# Altium schematic sheet PMIC-MX8M.SchDoc
size A2; SheetNumber: 7; SheetTotal: 15
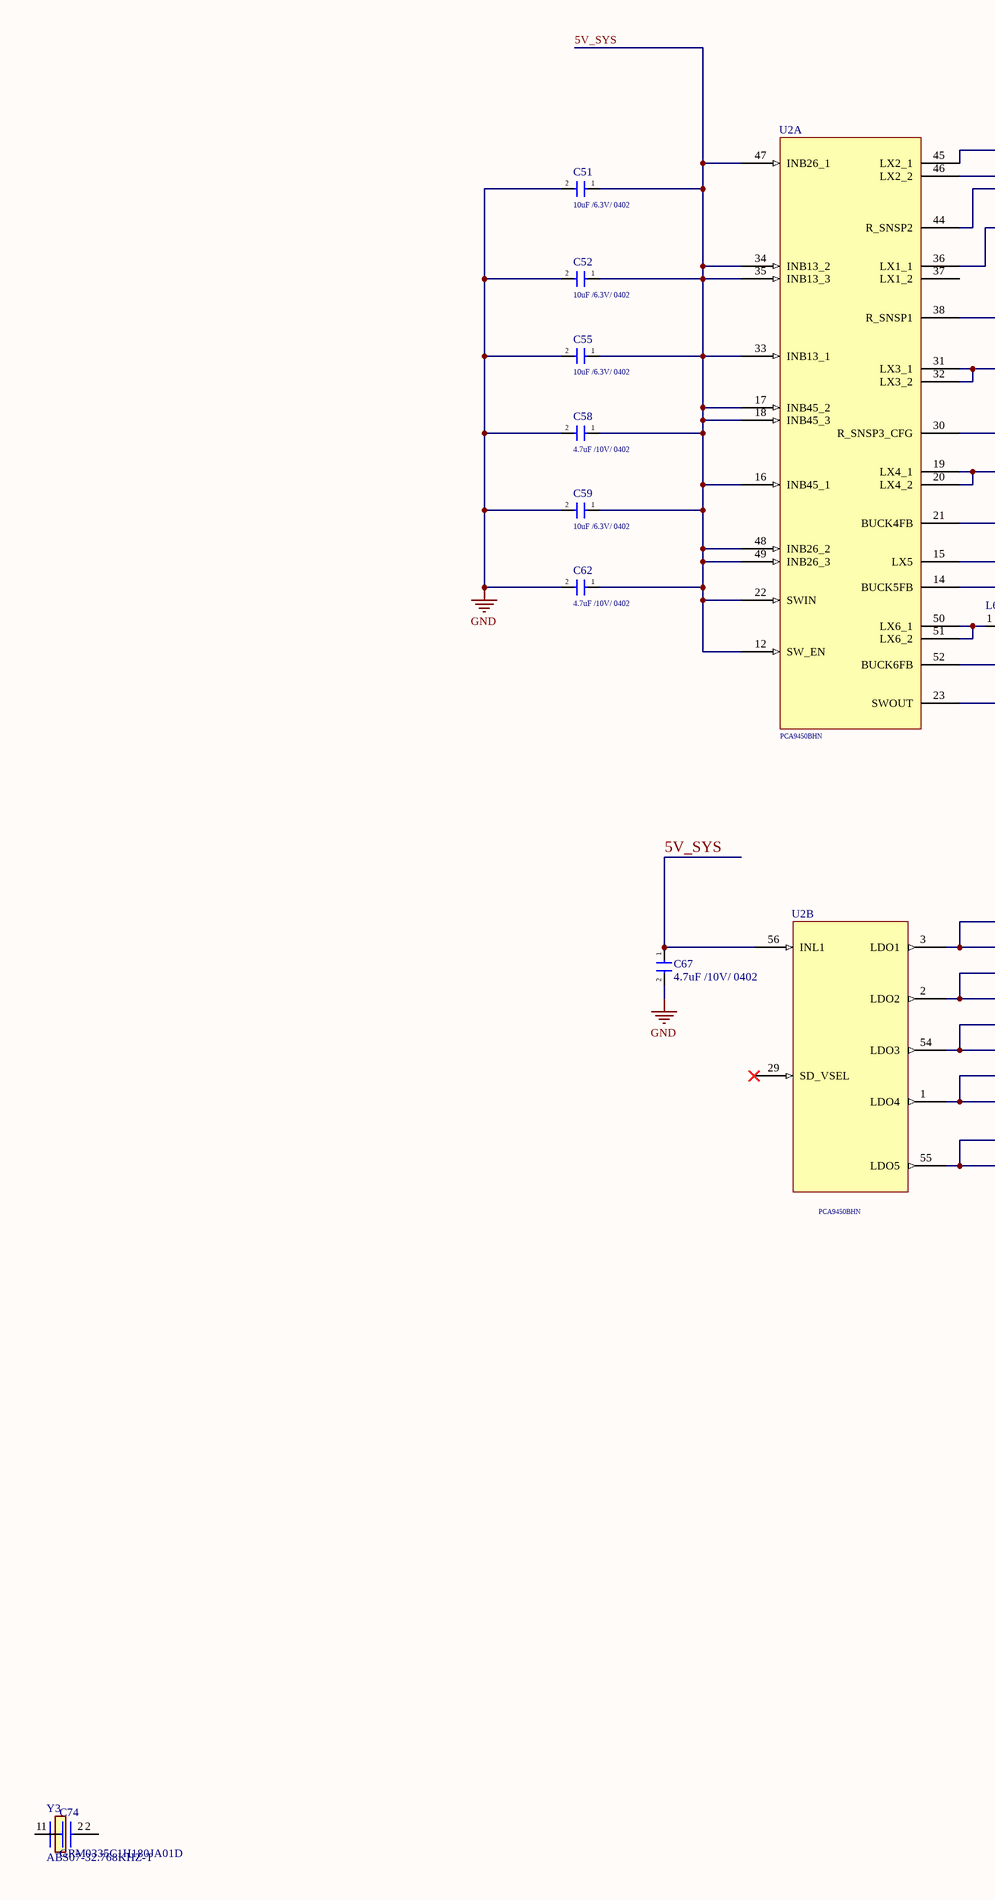
[diagram p0: PMIC-MX8M.SchDoc, left]
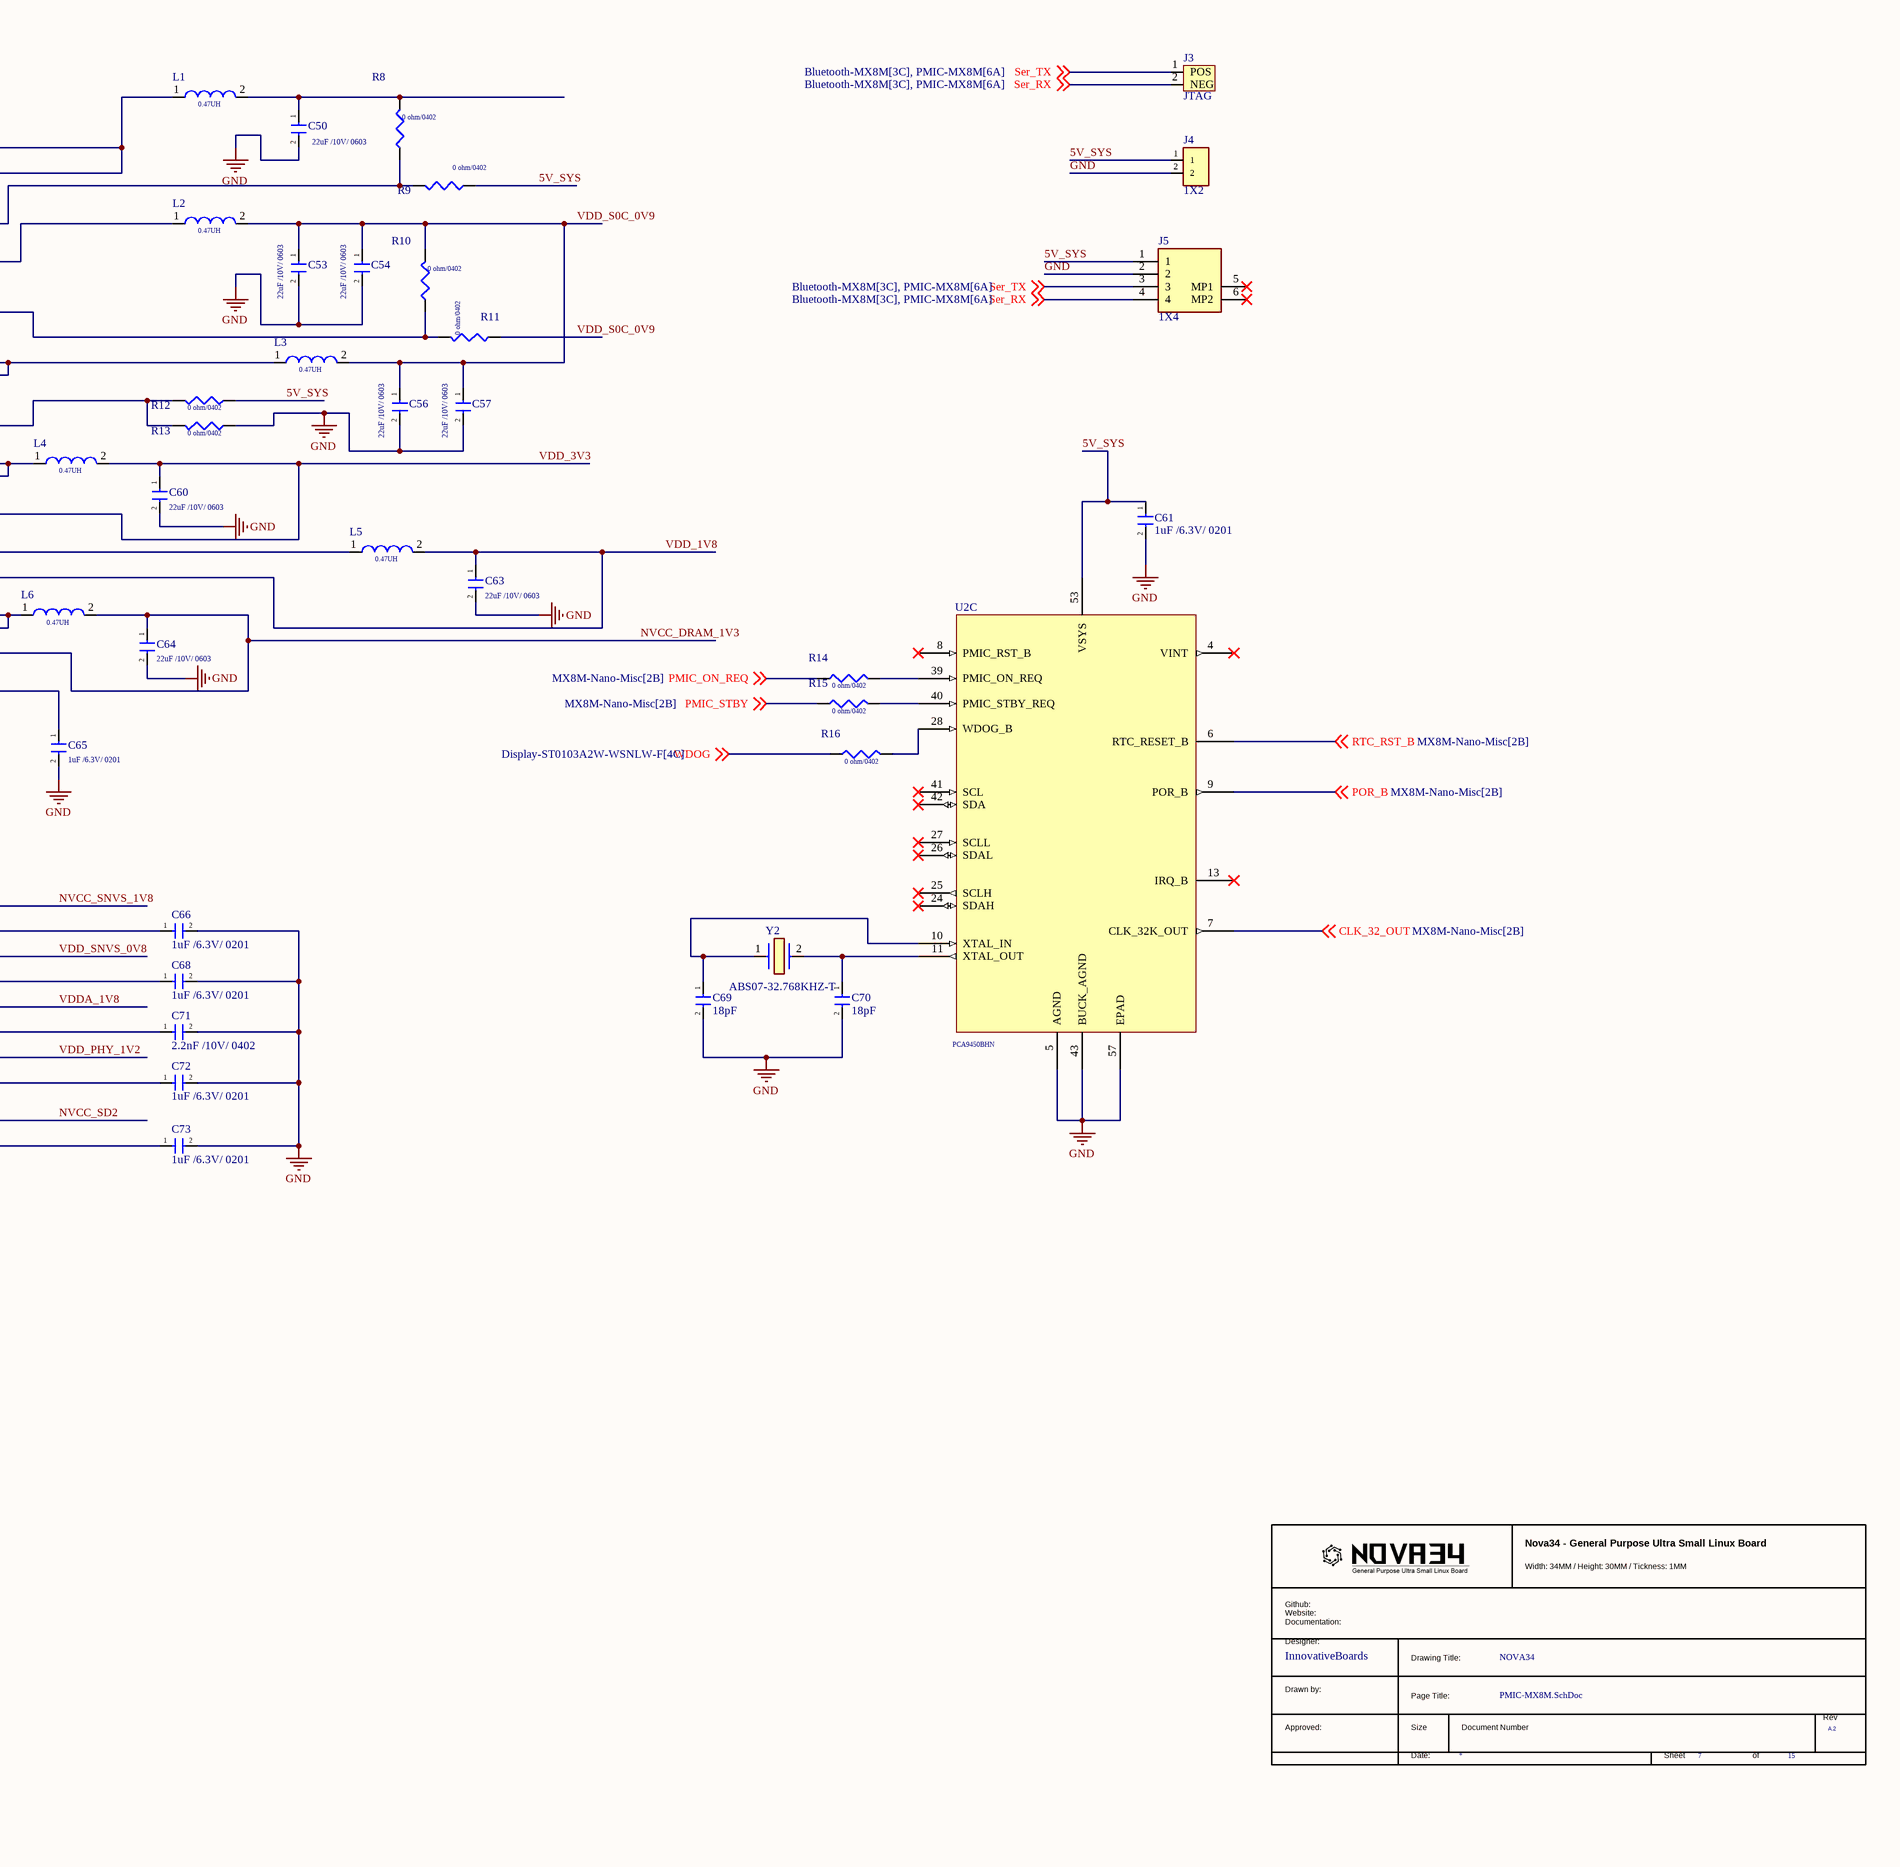
[diagram p1: PMIC-MX8M.SchDoc, right]

## Parts
*  RevCode: A.2  (hidden comment: TitleBlock_MCPG)  (graphical)
C50  22uF /10V/ 0603  [GRM18x]
C51  10uF /6.3V/ 0402  [CAPC1005X65N]
C52  10uF /6.3V/ 0402  [CAPC1005X65N]
C53  22uF /10V/ 0603  [GRM18x]
C54  22uF /10V/ 0603  [GRM18x]
C55  10uF /6.3V/ 0402  [CAPC1005X65N]
C56  22uF /10V/ 0603  [GRM18x]
C57  22uF /10V/ 0603  [GRM18x]
C58  4.7uF /10V/ 0402  [CAPC1005X70N]
C59  10uF /6.3V/ 0402  [CAPC1005X65N]
C60  22uF /10V/ 0603  [GRM18x]
C61  1uF /6.3V/ 0201  [GRM033D70J224ME01D]
C62  4.7uF /10V/ 0402  [CAPC1005X70N]
C63  22uF /10V/ 0603  [GRM18x]
C64  22uF /10V/ 0603  [GRM18x]
C65  1uF /6.3V/ 0201  [GRM033D70J224ME01D]
C66  1uF /6.3V/ 0201  [GRM033D70J224ME01D]
C67  4.7uF /10V/ 0402  [CAPC1005X70N]
C68  1uF /6.3V/ 0201  [GRM033D70J224ME01D]
C69  18pF  [CAPC0603X33N]
C70  18pF  [CAPC0603X33N]
C71  2.2nF /10V/ 0402  [CAPC1005X70N]
C72  1uF /6.3V/ 0201  [GRM033D70J224ME01D]
C73  1uF /6.3V/ 0201  [GRM033D70J224ME01D]
C74  GRM0335C1H180JA01D  [CAPC0603X33N]
J3  JTAG  [JTAG]
J4  1X2  [HDRV2W64P0X254_1X2_508X254X838P]
J5  1X4  [B4BZRSM4TFLFSN]
L1  0.47UH  [IND_SPH2520]
L2  0.47UH  [IND_SPH2520]
L3  0.47UH  [IND_SPH2520]
L4  0.47UH  [IND_SPH2520]
L5  0.47UH  [IND_SPH2520]
L6  0.47UH  [IND_SPH2520]
R8  0 ohm/0402  [RES_0402]
R9  0 ohm/0402  [RES_0402]
R10  0 ohm/0402  [RES_0402]
R11  0 ohm/0402  [RES_0402]
R12  0 ohm/0402  [RES_0402]
R13  0 ohm/0402  [RES_0402]
R14  0 ohm/0402  [RES_0402]
R15  0 ohm/0402  [RES_0402]
R16  0 ohm/0402  [RES_0402]
U2  PCA9450BHN  [QFN40P700X700X100-57N-D]  (parts A,B,C of 3)
Y2  ABS07-32.768KHZ-T  [ABS07]
Y3  ABS07-32.768KHZ-T  [ABS07]

## Nets
GND: C50.2 C51.2 C52.2 C53.2 C54.2 C55.2 C56.2 C57.2 C58.2 C59.2 C60.2 C61.2 C62.2 C63.2 C64.2 C65.2 C66.2 C67.2 C68.2 C69.2 C70.2 C71.2 C72.2 C73.2 J4.2 J5.2 R13.1 U2.5(AGND) U2.43(BUCK_AGND) U2.57(EPAD)
5V_SYS: C51.1 C52.1 C55.1 C58.1 C59.1 C61.1 C62.1 C67.1 J4.1 J5.1 R9.1 R12.1 U2.12(SW_EN) U2.16(INB45_1) U2.17(INB45_2) U2.18(INB45_3) U2.22(SWIN) U2.33(INB13_1) U2.34(INB13_2) U2.35(INB13_3) U2.47(INB26_1) U2.48(INB26_2) U2.49(INB26_3) U2.53(VSYS) U2.56(INL1)
CLK_32_OUT: U2.7(CLK_32K_OUT) ; off-sheet CLK_32_OUT
NVCC_DRAM_1V3: C64.1 L6.2 U2.52(BUCK6FB)
NVCC_SD2: C73.1 U2.55(LDO5)
NVCC_SNVS_1V8: C66.1 U2.3(LDO1)
PMIC_ON_REQ: R14.1 ; off-sheet PMIC_ON_REQ
PMIC_STBY: R15.1 ; off-sheet PMIC_STBY
POR_B: U2.9(POR_B) ; off-sheet POR_B
RTC_RST_B: U2.6(RTC_RESET_B) ; off-sheet RTC_RST_B
Ser_RX: J3.2(NEG) J5.4 ; off-sheet Ser_RX
Ser_TX: J3.1(POS) J5.3 ; off-sheet Ser_TX
VDD_1V8: C63.1 L5.2 U2.14(BUCK5FB)
VDD_3V3: C60.1 L4.2 U2.21(BUCK4FB)
VDD_PHY_1V2: C72.1 U2.1(LDO4)
VDD_S0C_0V9: C53.1 C54.1 C56.1 C57.1 L2.2 L3.2 R10.2 R11.1
VDD_SNVS_0V8: C68.1 U2.2(LDO2)
VDDA_1V8: C71.1 U2.54(LDO3)
WDOG: R16.1 ; off-sheet WDOG
NetC50_1: C50.1 L1.2 R8.2
NetC65_1: C65.1 U2.23(SWOUT)
NetC69_1: C69.1 U2.10(XTAL_IN) Y2.1
NetC70_1: C70.1 U2.11(XTAL_OUT) Y2.2
NetC74_1: C74.1 Y3.1
NetL1_1: L1.1 U2.45(LX2_1) U2.46(LX2_2)
NetL2_1: L2.1 U2.36(LX1_1)
NetL3_1: L3.1 U2.31(LX3_1) U2.32(LX3_2)
NetL4_1: L4.1 U2.19(LX4_1) U2.20(LX4_2)
NetL5_1: L5.1 U2.15(LX5)
NetL6_1: L6.1 U2.50(LX6_1) U2.51(LX6_2)
NetR8_1: R8.1 R9.2 U2.44(R_SNSP2)
NetR10_1: R10.1 R11.2 U2.38(R_SNSP1)
NetR12_2: R12.2 R13.2 U2.30(R_SNSP3_CFG)
NetR14_2: R14.2 U2.39(PMIC_ON_REQ)
NetR15_2: R15.2 U2.40(PMIC_STBY_REQ)
NetR16_2: R16.2 U2.28(WDOG_B)

Not connected (* = marked no-connect by the designer): C74 2; J5 5(MP1)* 6(MP2)*; U2 4(VINT)* 8(PMIC_RST_B)* 13(IRQ_B)* 24(SDAH)* 25(SCLH)* 26(SDAL)* 27(SCLL)* 29(SD_VSEL)* 37(LX1_2) 41(SCL)* 42(SDA)*; Y3 2

## Notes on the sheet
- (in symbol TitleBlock_MCPG) Nova34 - General Purpose Ultra Small Linux Board; Width: 34MM / Height: 30MM / Tickness: 1MM; Github: / Website: / Documentation:; Designer:; InnovativeBoards; Drawing Title:; NOVA34; Drawn by:; Page Title:; Rev; Approved:; Size; Document Number; Date:; Sheet; of

## Library data of the parts
C50 C53 C54 C56 C57 C60 C63 C64 = GRM187R61A226ME15D: Multilayer Ceramic Capacitors MLCC - SMD/SMT 22 uF 10 VDC 20% 0603 X5R; Manufacturer_Name: Murata Electronics; Datasheet Link: https://search.murata.co.jp/Ceramy/image/img/A01X/G101/ENG/GRM187R61A226ME15-01A.pdf; Height: 0.9mm; Manufacturer_Part_Number: GRM187R61A226ME15D; Mouser Part Number: 81-GRM187R61A226ME5D; Mouser Price/Stock: https://www.mouser.co.uk/ProductDetail/Murata-Electronics/GRM187R61A226ME15D?qs=I53XXhTNm8uUaeh8Eawx4Q%3D%3D; Arrow Part Number: GRM187R61A226ME15D; Arrow Price/Stock: https://www.arrow.com/en/products/grm187r61a226me15d/murata-manufacturing?region=nac
C51 C52 C55 C59 = GRM155R60J106ME15D: Multilayer Ceramic Capacitors MLCC - SMD/SMT 10 uF 6.3 VDC 20% 0402 X5R; Manufacturer_Name: Murata Electronics; Datasheet Link: https://search.murata.co.jp/Ceramy/image/img/A01X/G101/ENG/GRM155R60J106ME15-01A.pdf; Height: 0.65mm; Manufacturer_Part_Number: GRM155R60J106ME15D; Mouser Part Number: 81-GRM155R60J106ME5D; Mouser Price/Stock: https://www.mouser.co.uk/ProductDetail/Murata-Electronics/GRM155R60J106ME15D?qs=I53XXhTNm8s65u6%252BR3mHqw%3D%3D; Arrow Part Number: GRM155R60J106ME15D; Arrow Price/Stock: https://www.arrow.com/en/products/grm155r60j106me15d/murata-manufacturing?region=nac
C58 C62 C67 = GRT155C81A475ME13J: Multilayer Ceramic Capacitors MLCC - SMD/SMT 0402 X6S 4.7 F 20 10VDC AEC-Q200; Manufacturer_Name: Murata Electronics; Datasheet Link: https://search.murata.co.jp/Ceramy/image/img/A01X/G101/ENG/GRT155C81A475ME13-01A.pdf; Height: 0.7mm; Manufacturer_Part_Number: GRT155C81A475ME13J; Mouser Part Number: 81-GRT155C81A475ME3J; Mouser Price/Stock: https://www.mouser.co.uk/ProductDetail/Murata-Electronics/GRT155C81A475ME13J?qs=ufv2HEpFn%252BS%252BPUDm1eQCHw%3D%3D
C61 C65 C66 C68 C72 C73 = GRM033C80J105ME05J: Multilayer Ceramic Capacitors MLCC - SMD/SMT 1 uF 6.3 VDC 20% 0201 X6S; Manufacturer_Name: Murata Electronics; Datasheet Link: https://search.murata.co.jp/Ceramy/image/img/A01X/G101/ENG/GRM033C80J105ME05-01A.pdf; Height: 0.33mm; Manufacturer_Part_Number: GRM033C80J105ME05J; Mouser Part Number: 81-GRM033C80J105ME5J; Mouser Price/Stock: https://www.mouser.co.uk/ProductDetail/Murata-Electronics/GRM033C80J105ME05J?qs=5aG0NVq1C4we89LuRh7HJA%3D%3D; Arrow Part Number: GRM033C80J105ME05J; Arrow Price/Stock: https://www.arrow.com/en/products/grm033c80j105me05j/murata-manufacturing?region=nac
C69 C70 C74 = GRM0335C1H180JA01D: Capacitor; Manufacturer_Name: Murata Electronics; Datasheet Link: https://search.murata.co.jp/Ceramy/image/img/A01X/G101/ENG/GRM0335C1H180JA01-01A.pdf; Height: 0.33mm; Manufacturer_Part_Number: GRM0335C1H180JA01D; Mouser Part Number: 81-GRM0335C1H180JA1D; Mouser Price/Stock: https://www.mouser.co.uk/ProductDetail/Murata-Electronics/GRM0335C1H180JA01D?qs=lsk7mV%2FgRRLtYG1v2rvE9A%3D%3D; Arrow Part Number: GRM0335C1H180JA01D; Arrow Price/Stock: https://www.arrow.com/en/products/grm0335c1h180ja01d/murata-manufacturing
C71 = GRM155R61A222KA01D: Multilayer Ceramic Capacitors MLCC - SMD/SMT 2200 pF 10 VDC 10% 0402 X5R; Manufacturer_Name: Murata Electronics; Datasheet Link: https://search.murata.co.jp/Ceramy/image/img/A01X/G101/ENG/GRM155R61A222KA01-01A.pdf; Height: 0.7mm; Manufacturer_Part_Number: GRM155R61A222KA01D; Mouser Part Number: 81-GRM155R61A222KA1D; Mouser Price/Stock: https://www.mouser.co.uk/ProductDetail/Murata-Electronics/GRM155R61A222KA01D?qs=y02iAgv9n60wExGWvVZZNg%3D%3D
J4 = TSW-102-07-G-S-002: Connector; Manufacturer_Name: SAMTEC; Datasheet Link: http://suddendocs.samtec.com/prints/tsw-xxx-xx-xxx-x-xx-xxx-mkt.pdf; Height: 8.38mm; Manufacturer_Part_Number: TSW-102-07-G-S-002; Mouser Part Number: 200-TSW-10207GS002; Mouser Price/Stock: https://www.mouser.co.uk/ProductDetail/Samtec/TSW-102-07-G-S-002?qs=icabnvfcbsHvpvHCodBv1Q%3D%3D; Arrow Part Number: TSW-102-07-G-S-002; Arrow Price/Stock: https://www.arrow.com/en/products/tsw-102-07-g-s-002/samtec?region=nac
J5 = B4B-ZR-SM4-TF_LF__SN_: Connector; Manufacturer_Name: JST (JAPAN SOLDERLESS TERMINALS); Manufacturer_Part_Number: B4B-ZR-SM4-TF(LF)(SN); Datasheet Link: http://www.jst-mfg.com/product/pdf/eng/eZH.pdf; Height: 5mm; Mouser Part Number: N/A; Mouser Price/Stock: https://www.mouser.co.uk/ProductDetail/JST-Commercial/B4B-ZR-SM4-TFLFSN?qs=IKkN%2F947nfC%2FbT9OqR9GjQ%3D%3D; Arrow Part Number: B4B-ZR-SM4-TF(LF)(SN); Arrow Price/Stock: https://www.arrow.com/en/products/b4b-zr-sm4-tf-lf-sn/jst-manufacturing?region=europe
L1-L6 = WPN252012ER47MT: 470 nH Shielded Drum Core, Wirewound Inductor 4.1 A 32mOhm Max 1008 (2520 Metric); PART_TYPE: INDUCTOR\POWER; CLASS: DISCRETE; Temp Range: -40¡ãC to +125¡ãC; CAD_APPROVED: Yes; MFG_NAME01: SHENZHEN SUNLORD ELECTRONICS CO., LTD; TOL: 20%; AGILE_PN: 180-78647; HEIGHT: 1.2MM; Temp_Range: -40¡ãC to +125¡ãC; ROHS: Yes; MFG_PN01: WPN252012ER47MT; Tolerance: 20%; PCB Footprint: ind_sph2520
R8-R16 = RC0402JR-070RL: RES MF ZERO OHM 1/16W 5% 0402; CLASS: DISCRETE; AGILE_PN: 470-75394; MFG_NAME01: YAGEO AMERICA; CAD_APPROVED: Yes; FPLIST: RC0402_25,RC0402_HD,RC0402_X2,0402_CC; PCB Footprint: 0402_CC; Tolerance: 5%; MFG_PN01: RC0402JR-070RL; ROHS: Yes; HEIGHT: 0.45 MM; VOLTAGE: 1/16W
U2 = PCA9450_HVQFN56P_A: IC POWER MANAGEMENT 2.7-5.5V HVQFN56; SPLIT_INST: TRUE; SWAP_INFO: (S1+S2+S3); CAD_APPROVED: Yes; PRE_APN: 315-82314; Temp_Range: -40C to +105C; MFG_NAME01: NXP SEMICONDUCTORS; AGILE_PN: TMP-WF-36197; PCB Footprint: hvqfn56_0p4_7x7_ep4p7mm; CLASS: IC; HEIGHT: 1MM; ROHS: Yes; MFG_PN01: PCA9450BHN; VOLTAGE: 2.7-5.5V; Temp Range: -40C to +105C
Y2 Y3 = ABS07-32.768KHZ-T: Crystal or Oscillator; Manufacturer_Name: ABRACON; Datasheet Link: https://abracon.com/Resonators/ABS07.pdf; Height: 0.9mm; Manufacturer_Part_Number: ABS07-32.768KHZ-T; Mouser Part Number: 815-ABS07-32.768KHZT; Mouser Price/Stock: https://www.mouser.co.uk/ProductDetail/ABRACON/ABS07-32.768KHZ-T?qs=3SpAxaLJ01g8GJWeO3sA3Q%3D%3D; Arrow Part Number: ABS07-32.768KHZ-T; Arrow Price/Stock: https://www.arrow.com/en/products/abs07-32.768khz-t/abracon?utm_currency=USD&region=europe
* = TitleBlock_MCPG: Page Create Date: March  8, 1995